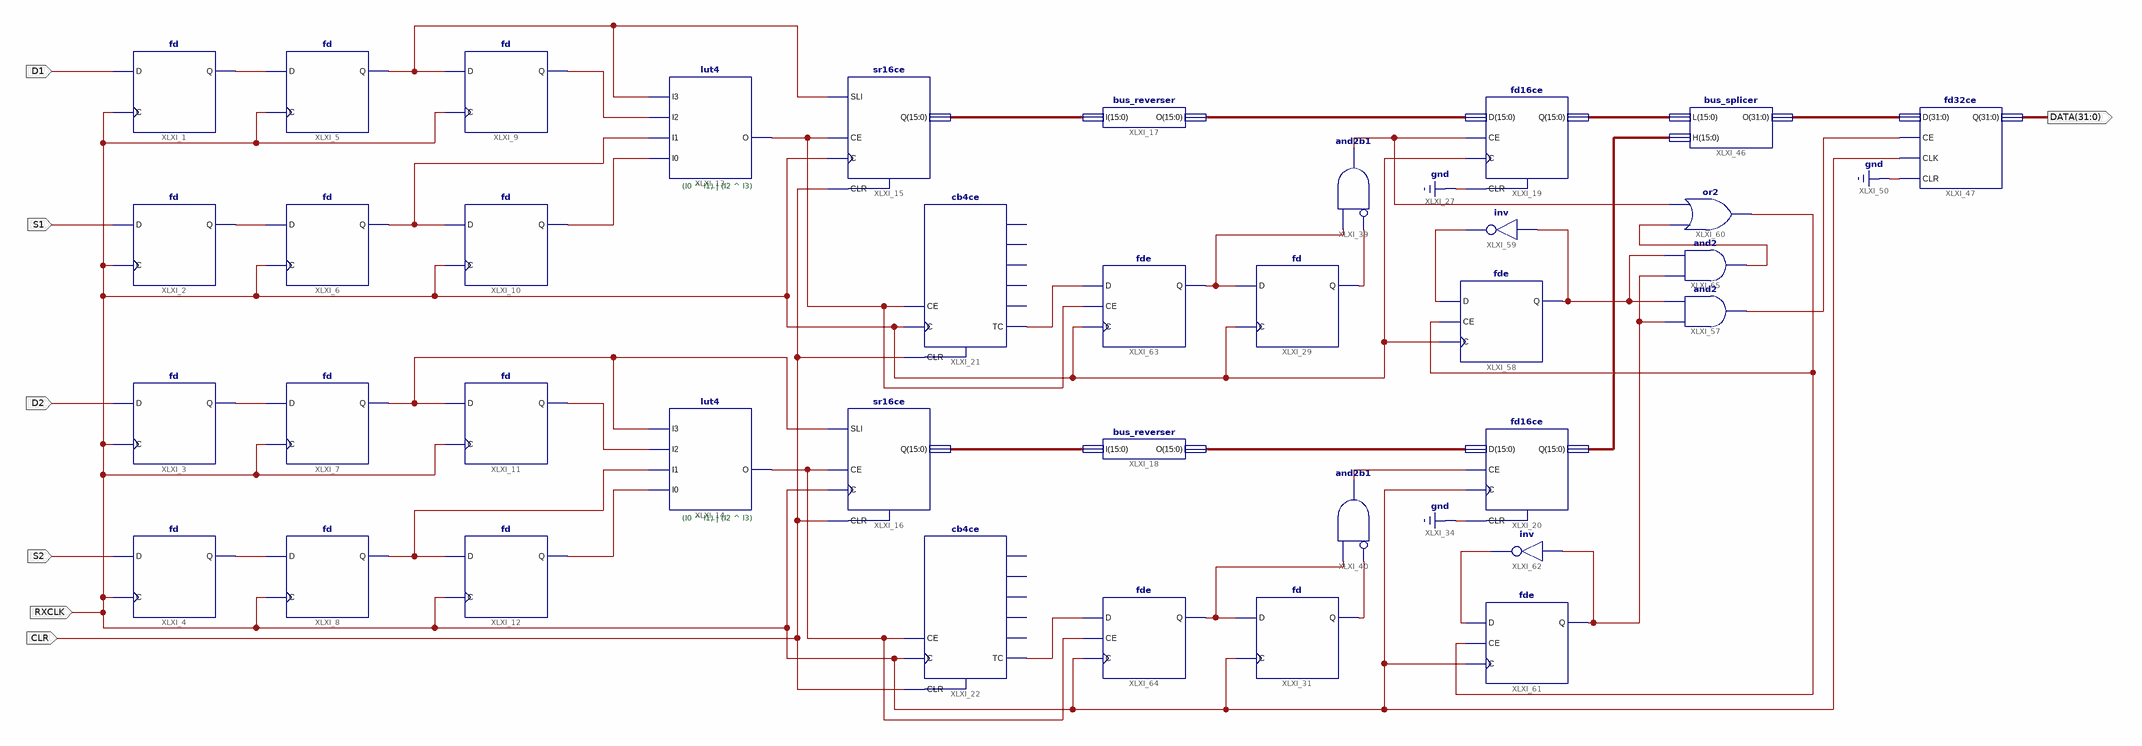
[diagram p0: schematic sheet 1]
// Xilinx ISE schematic spacewire_rx_x2.sch (spartan6) as structural Verilog: 37 symbols, 7 ports
module spacewire_rx_x2 (
  input  D1,
  input  S1,
  input  D2,
  input  S2,
  input  CLR,
  input  RXCLK,
  output [31:0] DATA
);

  wire XLXN_9, XLXN_10, XLXN_11, XLXN_12, XLXN_15, XLXN_27, XLXN_28, XLXN_29, XLXN_31, XLXN_34, XLXN_35,
       XLXN_36, XLXN_49, XLXN_64, XLXN_65, XLXN_76, XLXN_78, XLXN_88, XLXN_90, XLXN_190, XLXN_200, XLXN_203,
       XLXN_204, XLXN_205, XLXN_210, XLXN_213, XLXN_214, XLXN_215, XLXN_216;
  wire [15:0] XLXN_40, XLXN_41, XLXN_42, XLXN_43, XLXN_97, XLXN_98;
  wire [31:0] XLXN_182;

  fd XLXI_1 (.C(RXCLK), .D(D1), .Q(XLXN_12));
  fd XLXI_2 (.C(RXCLK), .D(S1), .Q(XLXN_11));
  fd XLXI_3 (.C(RXCLK), .D(D2), .Q(XLXN_10));
  fd XLXI_4 (.C(RXCLK), .D(S2), .Q(XLXN_9));
  fd XLXI_5 (.C(RXCLK), .D(XLXN_12), .Q(XLXN_27));
  fd XLXI_6 (.C(RXCLK), .D(XLXN_11), .Q(XLXN_31));
  fd XLXI_7 (.C(RXCLK), .D(XLXN_10), .Q(XLXN_15));
  fd XLXI_8 (.C(RXCLK), .D(XLXN_9), .Q(XLXN_35));
  fd XLXI_9 (.C(RXCLK), .D(XLXN_27), .Q(XLXN_28));
  fd XLXI_10 (.C(RXCLK), .D(XLXN_31), .Q(XLXN_29));
  fd XLXI_11 (.C(RXCLK), .D(XLXN_15), .Q(XLXN_34));
  fd XLXI_12 (.C(RXCLK), .D(XLXN_35), .Q(XLXN_36));
  lut4 #(.INIT("6FF6")) XLXI_13 (.I0(XLXN_29), .I1(XLXN_31), .I2(XLXN_28), .I3(XLXN_27), .O(XLXN_213));
  lut4 #(.INIT("6FF6")) XLXI_14 (.I0(XLXN_36), .I1(XLXN_35), .I2(XLXN_34), .I3(XLXN_15), .O(XLXN_49));
  sr16ce XLXI_15 (.C(RXCLK), .CE(XLXN_213), .CLR(CLR), .SLI(XLXN_27), .Q(XLXN_41));
  sr16ce XLXI_16 (.C(RXCLK), .CE(XLXN_49), .CLR(CLR), .SLI(XLXN_15), .Q(XLXN_40));
  bus_reverser XLXI_17 (.I(XLXN_41), .O(XLXN_43));
  bus_reverser XLXI_18 (.I(XLXN_40), .O(XLXN_42));
  cb4ce XLXI_21 (.C(RXCLK), .CE(XLXN_213), .CLR(CLR), .TC(XLXN_65));  // open: CEO, Q0, Q1, Q2, Q3
  cb4ce XLXI_22 (.C(RXCLK), .CE(XLXN_49), .CLR(CLR), .TC(XLXN_76));  // open: CEO, Q0, Q1, Q2, Q3
  fd XLXI_29 (.C(RXCLK), .D(XLXN_64), .Q(XLXN_88));
  fd XLXI_31 (.C(RXCLK), .D(XLXN_90), .Q(XLXN_78));
  fd16ce XLXI_20 (.C(RXCLK), .CE(XLXN_190), .CLR(1'b0), .D(XLXN_42), .Q(XLXN_98));
  fd16ce XLXI_19 (.C(RXCLK), .CE(XLXN_203), .CLR(1'b0), .D(XLXN_43), .Q(XLXN_97));
  and XLXI_39 (XLXN_203, ~XLXN_88, XLXN_64);  // and2b1
  and XLXI_40 (XLXN_190, ~XLXN_78, XLXN_90);  // and2b1
  bus_splicer XLXI_46 (.H(XLXN_98), .L(XLXN_97), .O(XLXN_182));
  fd32ce XLXI_47 (.CE(XLXN_214), .CLK(RXCLK), .CLR(1'b0), .D(XLXN_182), .Q(DATA));
  and XLXI_57 (XLXN_214, XLXN_216, XLXN_215);
  fde XLXI_58 (.C(RXCLK), .CE(XLXN_205), .D(XLXN_200), .Q(XLXN_215));
  not XLXI_59 (XLXN_200, XLXN_215);
  or XLXI_60 (XLXN_205, XLXN_204, XLXN_203);
  fde XLXI_61 (.C(RXCLK), .CE(XLXN_205), .D(XLXN_210), .Q(XLXN_216));
  not XLXI_62 (XLXN_210, XLXN_216);
  fde XLXI_63 (.C(RXCLK), .CE(XLXN_213), .D(XLXN_65), .Q(XLXN_64));
  fde XLXI_64 (.C(RXCLK), .CE(XLXN_49), .D(XLXN_76), .Q(XLXN_90));
  and XLXI_65 (XLXN_204, XLXN_216, XLXN_215);

  // Notes on the sheet:
  //   (I0 ^ I1) | (I2 ^ I3)
  //   (I0 ^ I1) | (I2 ^ I3)
endmodule
